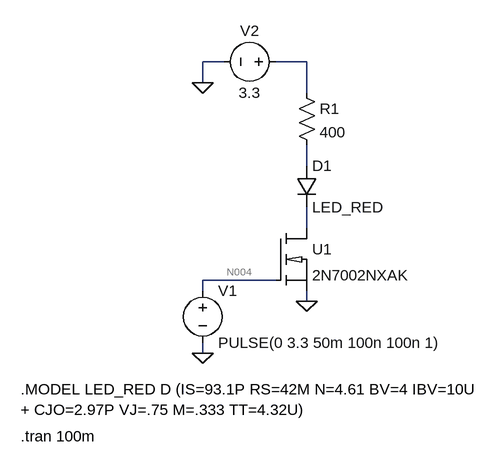
[diagram p0: schematic LED_FAULT.asc]
LED_FAULT.asc, the LTspice schematic file:
Version 4
SHEET 1 880 680
WIRE 32 -144 0 -144
WIRE 160 -144 112 -144
WIRE 0 -112 0 -144
WIRE 160 -96 160 -144
WIRE 160 16 160 -16
WIRE 160 112 160 80
WIRE 112 192 0 192
WIRE 0 208 0 192
WIRE 160 224 160 208
WIRE 0 304 0 288
FLAG 0 304 0
FLAG 160 224 0
FLAG 0 -112 0
SYMBOL 2N7002NXAK 112 112 R0
SYMATTR InstName U1
SYMBOL voltage 0 192 R0
WINDOW 123 0 0 Left 0
WINDOW 39 0 0 Left 0
SYMATTR InstName V1
SYMATTR Value PULSE(0 3.3 50m 100n 100n 1)
SYMBOL res 144 -112 R0
SYMATTR InstName R1
SYMATTR Value 400
SYMBOL diode 144 16 R0
SYMATTR InstName D1
SYMATTR Value LED_RED
SYMBOL voltage 128 -144 R90
WINDOW 0 -32 56 VBottom 2
WINDOW 3 32 56 VTop 2
WINDOW 123 0 0 Left 0
WINDOW 39 0 0 Left 0
SYMATTR InstName V2
SYMATTR Value 3.3
TEXT -280 360 Left 2 !.MODEL LED_RED D (IS=93.1P RS=42M N=4.61 BV=4 IBV=10U\n+ CJO=2.97P VJ=.75 M=.333 TT=4.32U)
TEXT -280 432 Left 2 !.tran 100m

The netlist it stands for:
* LED_FAULT.asc
XU1 N003 N004 0 2N7002NXAK  ; pins D G S
V1 N004 0 PULSE(0 3.3 50m 100n 100n 1)
R1 N001 N002 400
D1 N002 N003 LED_RED
V2 N001 0 3.3
.model D D
.lib standard.dio
.MODEL LED_RED D (IS=93.1P RS=42M N=4.61 BV=4 IBV=10U
+ CJO=2.97P VJ=.75 M=.333 TT=4.32U)
.tran 100m
.lib 2N7002NXAK.lib
.backanno
.end

* Results of the author's LTspice run, read from the files saved beside the schematic
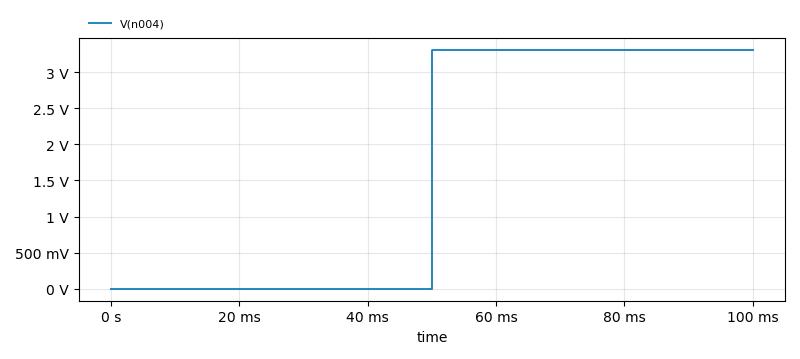
[diagram p1: Transient Analysis of LED_FAULT.asc, plotted from the saved traces]
* Transient Analysis, 1 run:
*   V(n004): min 0 V, max 3.3 V, average 1.65 V, rms 2.333 V, last 3.3 V